# EasyEDA schematic SCH_Ortho90_2023-07-25.json
TITLE: Mainboard; REV: 1.0; Date: 2023-06-22; Sheet: 1/1; Drawn By: Ella Pash
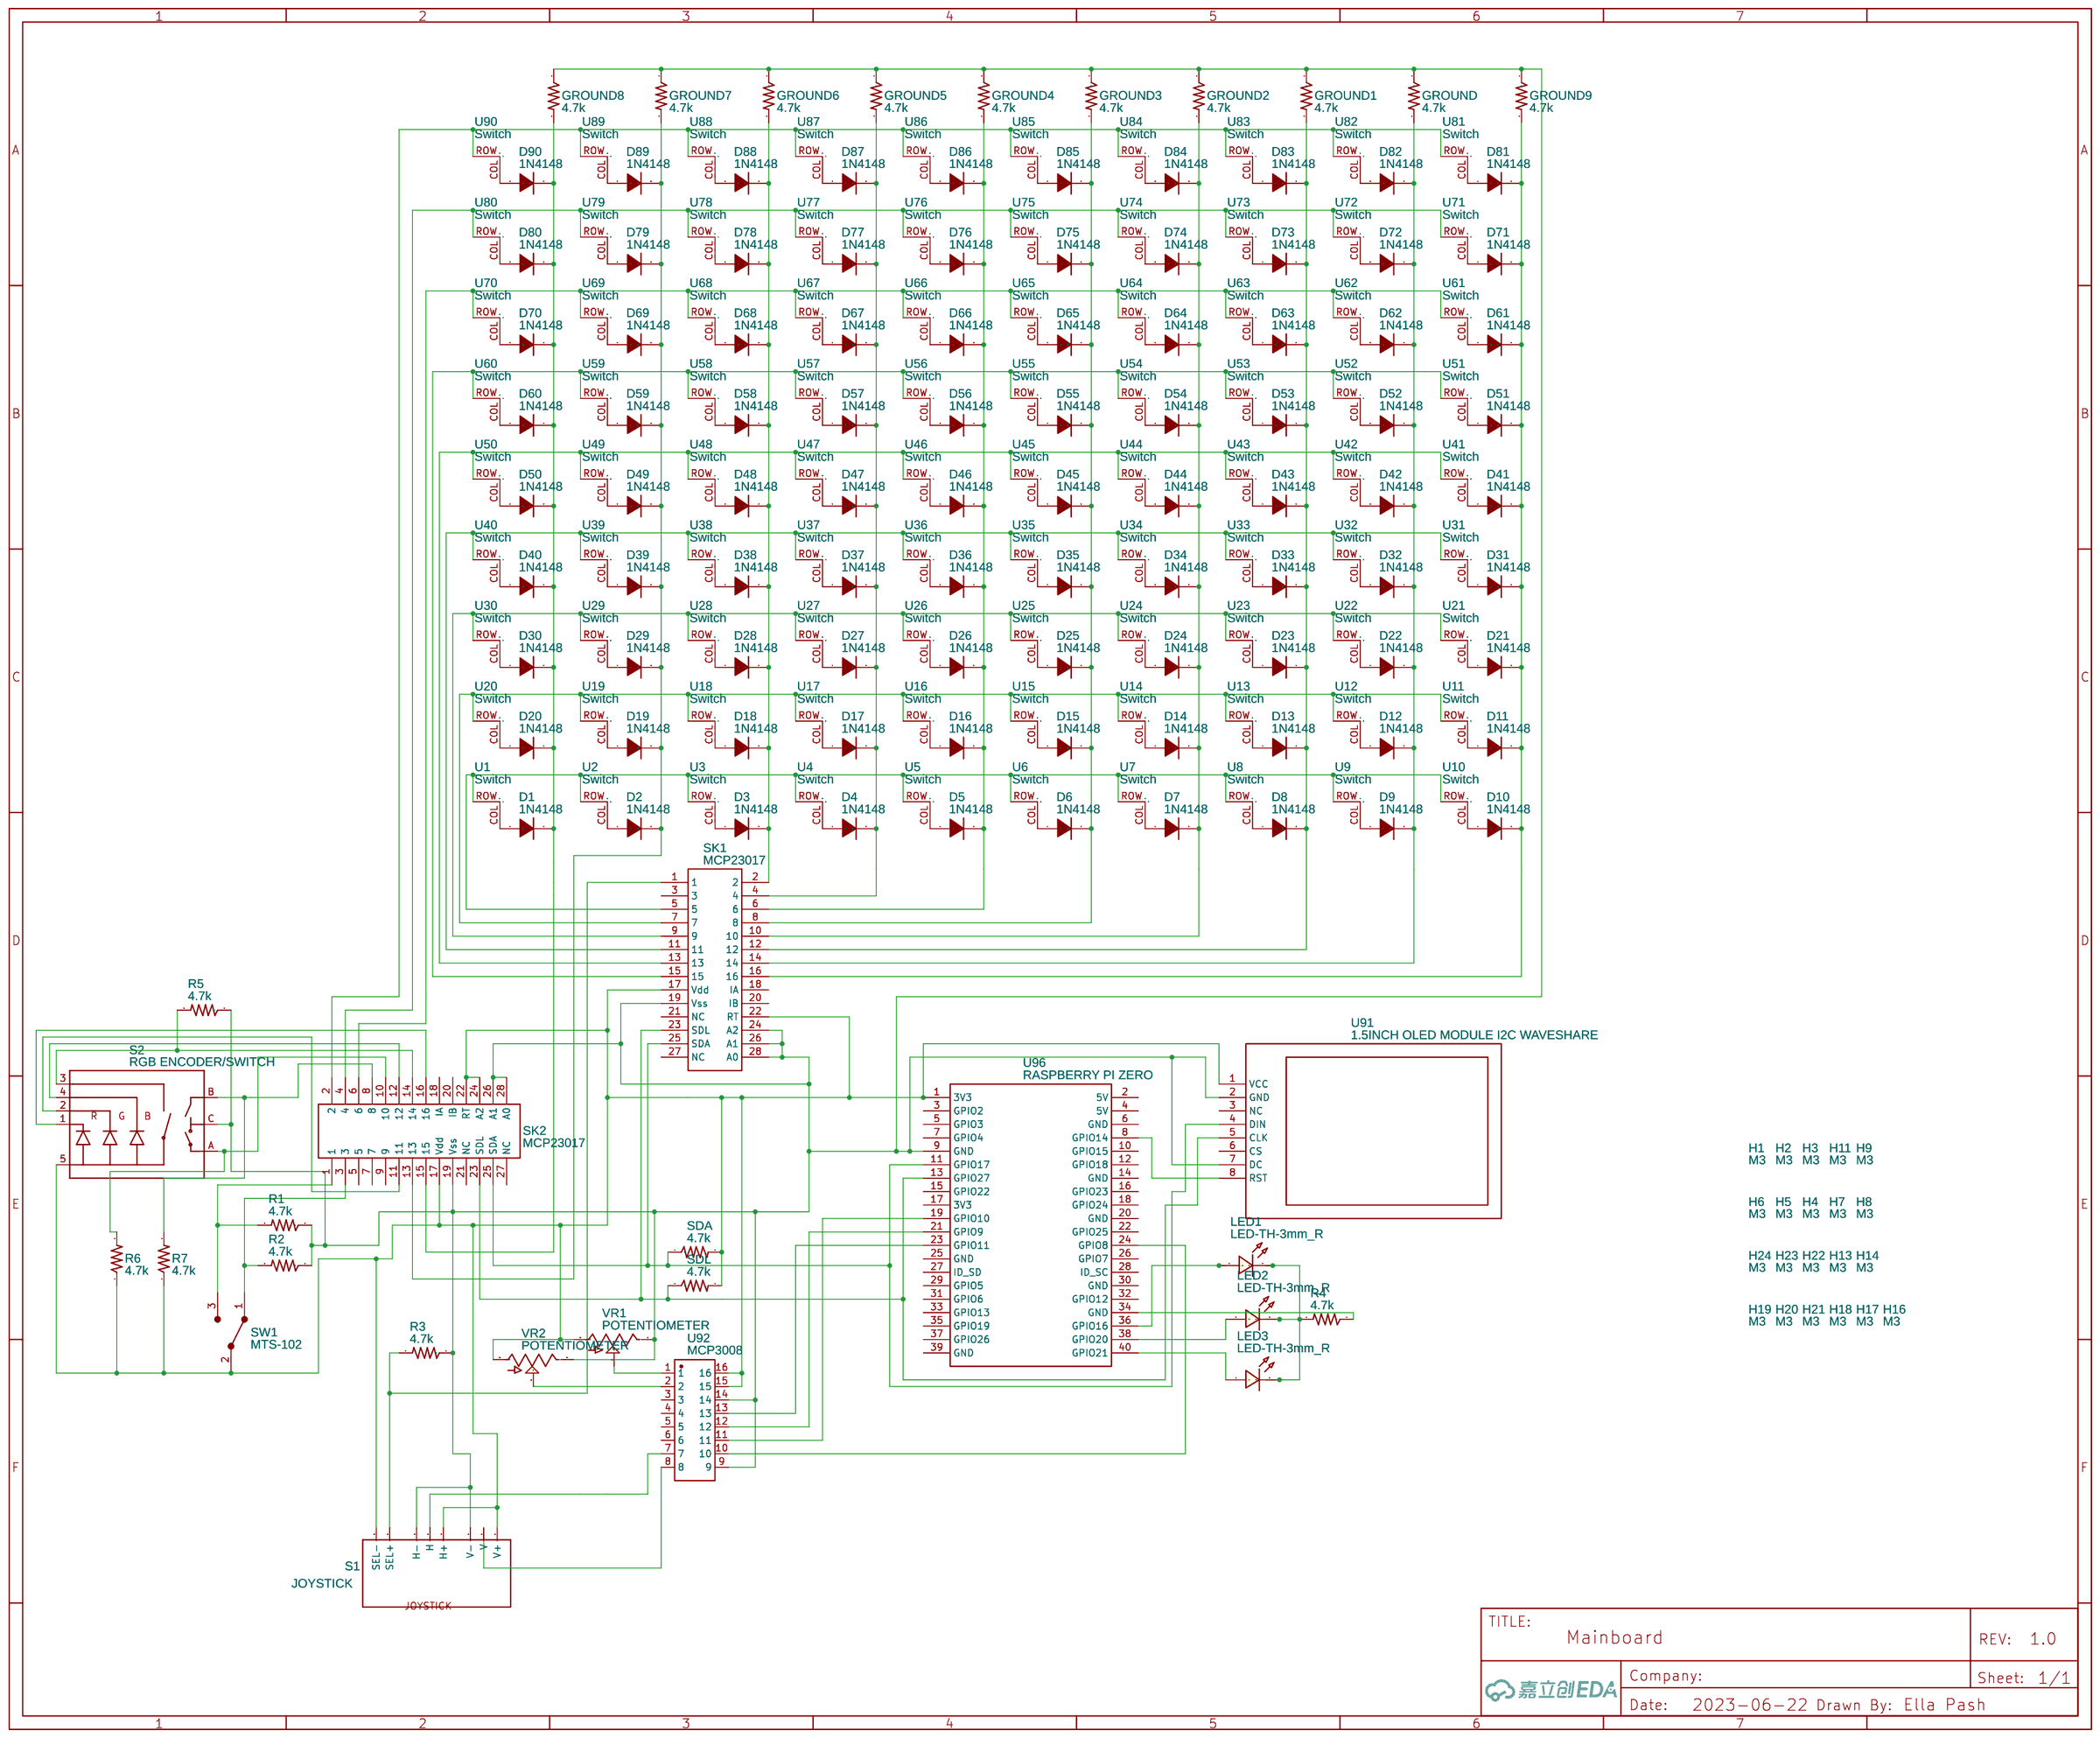
[diagram p0: schematic sheet]

## Parts
D1  1N4148  [DO-35_BD2.0-L4.0-P8.00-D0.5-FD]
D2  1N4148  [DO-35_BD2.0-L4.0-P8.00-D0.5-FD]
D3  1N4148  [DO-35_BD2.0-L4.0-P8.00-D0.5-FD]
D4  1N4148  [DO-35_BD2.0-L4.0-P8.00-D0.5-FD]
D5  1N4148  [DO-35_BD2.0-L4.0-P8.00-D0.5-FD]
D6  1N4148  [DO-35_BD2.0-L4.0-P8.00-D0.5-FD]
D7  1N4148  [DO-35_BD2.0-L4.0-P8.00-D0.5-FD]
D8  1N4148  [DO-35_BD2.0-L4.0-P8.00-D0.5-FD]
D9  1N4148  [DO-35_BD2.0-L4.0-P8.00-D0.5-FD]
D10  1N4148  [DO-35_BD2.0-L4.0-P8.00-D0.5-FD]
D11  1N4148  [DO-35_BD2.0-L4.0-P8.00-D0.5-FD]
D12  1N4148  [DO-35_BD2.0-L4.0-P8.00-D0.5-FD]
D13  1N4148  [DO-35_BD2.0-L4.0-P8.00-D0.5-FD]
D14  1N4148  [DO-35_BD2.0-L4.0-P8.00-D0.5-FD]
D15  1N4148  [DO-35_BD2.0-L4.0-P8.00-D0.5-FD]
D16  1N4148  [DO-35_BD2.0-L4.0-P8.00-D0.5-FD]
D17  1N4148  [DO-35_BD2.0-L4.0-P8.00-D0.5-FD]
D18  1N4148  [DO-35_BD2.0-L4.0-P8.00-D0.5-FD]
D19  1N4148  [DO-35_BD2.0-L4.0-P8.00-D0.5-FD]
D20  1N4148  [DO-35_BD2.0-L4.0-P8.00-D0.5-FD]
D21  1N4148  [DO-35_BD2.0-L4.0-P8.00-D0.5-FD]
D22  1N4148  [DO-35_BD2.0-L4.0-P8.00-D0.5-FD]
D23  1N4148  [DO-35_BD2.0-L4.0-P8.00-D0.5-FD]
D24  1N4148  [DO-35_BD2.0-L4.0-P8.00-D0.5-FD]
D25  1N4148  [DO-35_BD2.0-L4.0-P8.00-D0.5-FD]
D26  1N4148  [DO-35_BD2.0-L4.0-P8.00-D0.5-FD]
D27  1N4148  [DO-35_BD2.0-L4.0-P8.00-D0.5-FD]
D28  1N4148  [DO-35_BD2.0-L4.0-P8.00-D0.5-FD]
D29  1N4148  [DO-35_BD2.0-L4.0-P8.00-D0.5-FD]
D30  1N4148  [DO-35_BD2.0-L4.0-P8.00-D0.5-FD]
D31  1N4148  [DO-35_BD2.0-L4.0-P8.00-D0.5-FD]
D32  1N4148  [DO-35_BD2.0-L4.0-P8.00-D0.5-FD]
D33  1N4148  [DO-35_BD2.0-L4.0-P8.00-D0.5-FD]
D34  1N4148  [DO-35_BD2.0-L4.0-P8.00-D0.5-FD]
D35  1N4148  [DO-35_BD2.0-L4.0-P8.00-D0.5-FD]
D36  1N4148  [DO-35_BD2.0-L4.0-P8.00-D0.5-FD]
D37  1N4148  [DO-35_BD2.0-L4.0-P8.00-D0.5-FD]
D38  1N4148  [DO-35_BD2.0-L4.0-P8.00-D0.5-FD]
D39  1N4148  [DO-35_BD2.0-L4.0-P8.00-D0.5-FD]
D40  1N4148  [DO-35_BD2.0-L4.0-P8.00-D0.5-FD]
D41  1N4148  [DO-35_BD2.0-L4.0-P8.00-D0.5-FD]
D42  1N4148  [DO-35_BD2.0-L4.0-P8.00-D0.5-FD]
D43  1N4148  [DO-35_BD2.0-L4.0-P8.00-D0.5-FD]
D44  1N4148  [DO-35_BD2.0-L4.0-P8.00-D0.5-FD]
D45  1N4148  [DO-35_BD2.0-L4.0-P8.00-D0.5-FD]
D46  1N4148  [DO-35_BD2.0-L4.0-P8.00-D0.5-FD]
D47  1N4148  [DO-35_BD2.0-L4.0-P8.00-D0.5-FD]
D48  1N4148  [DO-35_BD2.0-L4.0-P8.00-D0.5-FD]
D49  1N4148  [DO-35_BD2.0-L4.0-P8.00-D0.5-FD]
D50  1N4148  [DO-35_BD2.0-L4.0-P8.00-D0.5-FD]
D51  1N4148  [DO-35_BD2.0-L4.0-P8.00-D0.5-FD]
D52  1N4148  [DO-35_BD2.0-L4.0-P8.00-D0.5-FD]
D53  1N4148  [DO-35_BD2.0-L4.0-P8.00-D0.5-FD]
D54  1N4148  [DO-35_BD2.0-L4.0-P8.00-D0.5-FD]
D55  1N4148  [DO-35_BD2.0-L4.0-P8.00-D0.5-FD]
D56  1N4148  [DO-35_BD2.0-L4.0-P8.00-D0.5-FD]
D57  1N4148  [DO-35_BD2.0-L4.0-P8.00-D0.5-FD]
D58  1N4148  [DO-35_BD2.0-L4.0-P8.00-D0.5-FD]
D59  1N4148  [DO-35_BD2.0-L4.0-P8.00-D0.5-FD]
D60  1N4148  [DO-35_BD2.0-L4.0-P8.00-D0.5-FD]
D61  1N4148  [DO-35_BD2.0-L4.0-P8.00-D0.5-FD]
D62  1N4148  [DO-35_BD2.0-L4.0-P8.00-D0.5-FD]
D63  1N4148  [DO-35_BD2.0-L4.0-P8.00-D0.5-FD]
D64  1N4148  [DO-35_BD2.0-L4.0-P8.00-D0.5-FD]
D65  1N4148  [DO-35_BD2.0-L4.0-P8.00-D0.5-FD]
D66  1N4148  [DO-35_BD2.0-L4.0-P8.00-D0.5-FD]
D67  1N4148  [DO-35_BD2.0-L4.0-P8.00-D0.5-FD]
D68  1N4148  [DO-35_BD2.0-L4.0-P8.00-D0.5-FD]
D69  1N4148  [DO-35_BD2.0-L4.0-P8.00-D0.5-FD]
D70  1N4148  [DO-35_BD2.0-L4.0-P8.00-D0.5-FD]
D71  1N4148  [DO-35_BD2.0-L4.0-P8.00-D0.5-FD]
D72  1N4148  [DO-35_BD2.0-L4.0-P8.00-D0.5-FD]
D73  1N4148  [DO-35_BD2.0-L4.0-P8.00-D0.5-FD]
D74  1N4148  [DO-35_BD2.0-L4.0-P8.00-D0.5-FD]
D75  1N4148  [DO-35_BD2.0-L4.0-P8.00-D0.5-FD]
D76  1N4148  [DO-35_BD2.0-L4.0-P8.00-D0.5-FD]
D77  1N4148  [DO-35_BD2.0-L4.0-P8.00-D0.5-FD]
D78  1N4148  [DO-35_BD2.0-L4.0-P8.00-D0.5-FD]
D79  1N4148  [DO-35_BD2.0-L4.0-P8.00-D0.5-FD]
D80  1N4148  [DO-35_BD2.0-L4.0-P8.00-D0.5-FD]
D81  1N4148  [DO-35_BD2.0-L4.0-P8.00-D0.5-FD]
D82  1N4148  [DO-35_BD2.0-L4.0-P8.00-D0.5-FD]
D83  1N4148  [DO-35_BD2.0-L4.0-P8.00-D0.5-FD]
D84  1N4148  [DO-35_BD2.0-L4.0-P8.00-D0.5-FD]
D85  1N4148  [DO-35_BD2.0-L4.0-P8.00-D0.5-FD]
D86  1N4148  [DO-35_BD2.0-L4.0-P8.00-D0.5-FD]
D87  1N4148  [DO-35_BD2.0-L4.0-P8.00-D0.5-FD]
D88  1N4148  [DO-35_BD2.0-L4.0-P8.00-D0.5-FD]
D89  1N4148  [DO-35_BD2.0-L4.0-P8.00-D0.5-FD]
D90  1N4148  [DO-35_BD2.0-L4.0-P8.00-D0.5-FD]
GROUND  4.7k  [AXIAL-0.3-KIT]
GROUND1  4.7k  [AXIAL-0.3-KIT]
GROUND2  4.7k  [AXIAL-0.3-KIT]
GROUND3  4.7k  [AXIAL-0.3-KIT]
GROUND4  4.7k  [AXIAL-0.3-KIT]
GROUND5  4.7k  [AXIAL-0.3-KIT]
GROUND6  4.7k  [AXIAL-0.3-KIT]
GROUND7  4.7k  [AXIAL-0.3-KIT]
GROUND8  4.7k  [AXIAL-0.3-KIT]
GROUND9  4.7k  [AXIAL-0.3-KIT]
H1  M3  [MOUNTINGHOLE_3.2MM_M3]
H2  M3  [MOUNTINGHOLE_3.2MM_M3]
H3  M3  [MOUNTINGHOLE_3.2MM_M3]
H4  M3  [MOUNTINGHOLE_3.2MM_M3]
H5  M3  [MOUNTINGHOLE_3.2MM_M3]
H6  M3  [MOUNTINGHOLE_3.2MM_M3]
H7  M3  [MOUNTINGHOLE_3.2MM_M3]
H8  M3  [MOUNTINGHOLE_3.2MM_M3]
H9  M3  [MOUNTINGHOLE_3.2MM_M3]
H11  M3  [MOUNTINGHOLE_3.2MM_M3]
H13  M3  [MOUNTINGHOLE_3.2MM_M3]
H14  M3  [MOUNTINGHOLE_3.2MM_M3]
H16  M3  [MOUNTINGHOLE_3.2MM_M3]
H17  M3  [MOUNTINGHOLE_3.2MM_M3]
H18  M3  [MOUNTINGHOLE_3.2MM_M3]
H19  M3  [MOUNTINGHOLE_3.2MM_M3]
H20  M3  [MOUNTINGHOLE_3.2MM_M3]
H21  M3  [MOUNTINGHOLE_3.2MM_M3]
H22  M3  [MOUNTINGHOLE_3.2MM_M3]
H23  M3  [MOUNTINGHOLE_3.2MM_M3]
H24  M3  [MOUNTINGHOLE_3.2MM_M3]
LED1  LED-TH-3mm_R  [LED-TH_BD3.0_RED]
LED2  LED-TH-3mm_R  [LED-TH_BD3.0_RED]
LED3  LED-TH-3mm_R  [LED-TH_BD3.0_RED]
R1  4.7k  [AXIAL-0.3-KIT]
R2  4.7k  [AXIAL-0.3-KIT]
R3  4.7k  [AXIAL-0.3-KIT]
R4  4.7k  [AXIAL-0.3-KIT]
R5  4.7k  [AXIAL-0.3-KIT]
R6  4.7k  [AXIAL-0.3-KIT]
R7  4.7k  [AXIAL-0.3-KIT]
S1  JOYSTICK  [JOYSTICK]
S2  RGB ENCODER/SWITCH  [ENCODER_LED_3]
SDA  4.7k  [AXIAL-0.3-KIT]
SDL  4.7k  [AXIAL-0.3-KIT]
SK1  MCP23017  [DIP-28_L36.0-W10.2-P2.54-LS10.2-BL]
SK2  MCP23017  [DIP-28_L36.0-W10.2-P2.54-LS10.2-BL]
SW1  MTS-102  [MTS-102]
U1  Switch  [CHERRY MX 1U]
U2  Switch  [CHERRY MX 1U]
U3  Switch  [CHERRY MX 1U]
U4  Switch  [CHERRY MX 1U]
U5  Switch  [CHERRY MX 1U]
U6  Switch  [CHERRY MX 1U]
U7  Switch  [CHERRY MX 1U]
U8  Switch  [CHERRY MX 1U]
U9  Switch  [CHERRY MX 1U]
U10  Switch  [CHERRY MX 1U]
U11  Switch  [CHERRY MX 1U]
U12  Switch  [CHERRY MX 1U]
U13  Switch  [CHERRY MX 1U]
U14  Switch  [CHERRY MX 1U]
U15  Switch  [CHERRY MX 1U]
U16  Switch  [CHERRY MX 1U]
U17  Switch  [CHERRY MX 1U]
U18  Switch  [CHERRY MX 1U]
U19  Switch  [CHERRY MX 1U]
U20  Switch  [CHERRY MX 1U]
U21  Switch  [CHERRY MX 1U]
U22  Switch  [CHERRY MX 1U]
U23  Switch  [CHERRY MX 1U]
U24  Switch  [CHERRY MX 1U]
U25  Switch  [CHERRY MX 1U]
U26  Switch  [CHERRY MX 1U]
U27  Switch  [CHERRY MX 1U]
U28  Switch  [CHERRY MX 1U]
U29  Switch  [CHERRY MX 1U]
U30  Switch  [CHERRY MX 1U]
U31  Switch  [CHERRY MX 1U]
U32  Switch  [CHERRY MX 1U]
U33  Switch  [CHERRY MX 1U]
U34  Switch  [CHERRY MX 1U]
U35  Switch  [CHERRY MX 1U]
U36  Switch  [CHERRY MX 1U]
U37  Switch  [CHERRY MX 1U]
U38  Switch  [CHERRY MX 1U]
U39  Switch  [CHERRY MX 1U]
U40  Switch  [CHERRY MX 1U]
U41  Switch  [CHERRY MX 1U]
U42  Switch  [CHERRY MX 1U]
U43  Switch  [CHERRY MX 1U]
U44  Switch  [CHERRY MX 1U]
U45  Switch  [CHERRY MX 1U]
U46  Switch  [CHERRY MX 1U]
U47  Switch  [CHERRY MX 1U]
U48  Switch  [CHERRY MX 1U]
U49  Switch  [CHERRY MX 1U]
U50  Switch  [CHERRY MX 1U]
U51  Switch  [CHERRY MX 1U]
U52  Switch  [CHERRY MX 1U]
U53  Switch  [CHERRY MX 1U]
U54  Switch  [CHERRY MX 1U]
U55  Switch  [CHERRY MX 1U]
U56  Switch  [CHERRY MX 1U]
U57  Switch  [CHERRY MX 1U]
U58  Switch  [CHERRY MX 1U]
U59  Switch  [CHERRY MX 1U]
U60  Switch  [CHERRY MX 1U]
U61  Switch  [CHERRY MX 1U]
U62  Switch  [CHERRY MX 1U]
U63  Switch  [CHERRY MX 1U]
U64  Switch  [CHERRY MX 1U]
U65  Switch  [CHERRY MX 1U]
U66  Switch  [CHERRY MX 1U]
U67  Switch  [CHERRY MX 1U]
U68  Switch  [CHERRY MX 1U]
U69  Switch  [CHERRY MX 1U]
U70  Switch  [CHERRY MX 1U]
U71  Switch  [CHERRY MX 1U]
U72  Switch  [CHERRY MX 1U]
U73  Switch  [CHERRY MX 1U]
U74  Switch  [CHERRY MX 1U]
U75  Switch  [CHERRY MX 1U]
U76  Switch  [CHERRY MX 1U]
U77  Switch  [CHERRY MX 1U]
U78  Switch  [CHERRY MX 1U]
U79  Switch  [CHERRY MX 1U]
U80  Switch  [CHERRY MX 1U]
U81  Switch  [CHERRY MX 1U]
U82  Switch  [CHERRY MX 1U]
U83  Switch  [CHERRY MX 1U]
U84  Switch  [CHERRY MX 1U]
U85  Switch  [CHERRY MX 1U]
U86  Switch  [CHERRY MX 1U]
U87  Switch  [CHERRY MX 1U]
U88  Switch  [CHERRY MX 1U]
U89  Switch  [CHERRY MX 1U]
U90  Switch  [CHERRY MX 1U]
U91  1.5INCH OLED MODULE I2C WAVESHARE  [1.5INCH OLED MODULE WAVESHARE]
U92  MCP3008  [DIP-16_L20.3-W10.2-P2.54-LS7.6-BL-1]
U96  RASPBERRY PI ZERO  [RASPBERRY-PIZERO-W]
VR1  POTENTIOMETER  [POT-PTH-ALPS]
VR2  POTENTIOMETER  [POT-PTH-ALPS]

## Library data of the parts
D1-D90 = 1N4148: Supplier: LCSC; Manufacturer: ST(先科); Supplier Part: C14516; JLCPCB Part Class: Extended Part
GROUND GROUND1-GROUND9 R1-R7 SDA SDL = RESISTORKIT: Resistor; Contributor: SparkFun
H1-H9 H11 H13 H14 H16-H24 = MountingHole_3.2mm_M3: Contributor: Robson Cozendey; Convert to PCB: Yes; Add into BOM: No
LED1-LED3 = LED-TH-3mm_R: Manufacturer: EVERLIGHT(台湾亿光); Manufacturer Part: 204-10SDRD/S530-A3-L; Supplier Part: C84774; Supplier: LCSC; Contributor: LCEDA_Lib
S1 = JOYSTICK_THUMB: Contributor: ellarushtonpash
S2 = ENCODER-RGB-SWITCH-NO_NUT: Contributor: ellarushtonpash
SK1 SK2 = IC seat: Supplier: LCSC; Supplier Part: C16653; Manufacturer: BOOMELE(博穆精密); Manufacturer Part: IC-28P窄; Contributor: LCSC; JLCPCB Part Class: Extended Part
SW1 = MTS-102: Manufacturer Part: New SchematicLib; Contributor: vladimir_box; Supplier Part: SMTS-202-A2; Supplier: MASSUSE
U1-U90 = Switch: Contributor: ellarushtonpash
U91 = 1.5INCH OLED MODULE SPI-I2C WAVESHARE (HOLE D3.2MM): Manufacturer Part: Waveshare; Contributor: allvex
U92 = IC-16P: Supplier: LCSC; Supplier Part: C5289487; Manufacturer: ZHOURI(洲日); link: https://atta.szlcsc.com/upload/public/pdf/source/20221125/CA58E3030C287CE73D9114A1B28DE960.pdf; Contributor: lcsc
U96 = Raspberry-PiZero-W: Contributor: Emílio Gabriel Dallastella
VR1 VR2 = POTENTIOMETER-PTH-9MM-1/20W-20%: Contributor: ellarushtonpash

## Nets
Net-(D1-1): D1.1(A) U1.COL(2)
Net-(D1-2): D1.2(C) D20.2(C) D30.2(C) D40.2(C) D50.2(C) D60.2(C) D70.2(C) D80.2(C) D90.2(C) GROUND8.2 SK2.15
Net-(D2-1): D2.1(A) U2.COL(2)
Net-(D2-2): D2.2(C) D19.2(C) D29.2(C) D39.2(C) D49.2(C) D59.2(C) D69.2(C) D79.2(C) D89.2(C) GROUND7.2 SK2.13
Net-(D3-1): D3.1(A) U3.COL(2)
Net-(D3-2): D3.2(C) D18.2(C) D28.2(C) D38.2(C) D48.2(C) D58.2(C) D68.2(C) D78.2(C) D88.2(C) GROUND6.2 SK1.2
Net-(D4-1): D4.1(A) U4.COL(2)
Net-(D4-2): D4.2(C) D17.2(C) D27.2(C) D37.2(C) D47.2(C) D57.2(C) D67.2(C) D77.2(C) D87.2(C) GROUND5.2 SK1.4
Net-(D5-1): D5.1(A) U5.COL(2)
Net-(D5-2): D5.2(C) D16.2(C) D26.2(C) D36.2(C) D46.2(C) D56.2(C) D66.2(C) D76.2(C) D86.2(C) GROUND4.2 SK1.6
Net-(D6-1): D6.1(A) U6.COL(2)
Net-(D6-2): D6.2(C) D15.2(C) D25.2(C) D35.2(C) D45.2(C) D55.2(C) D65.2(C) D75.2(C) D85.2(C) GROUND3.2 SK1.8
Net-(D7-1): D7.1(A) U7.COL(2)
Net-(D7-2): D7.2(C) D14.2(C) D24.2(C) D34.2(C) D44.2(C) D54.2(C) D64.2(C) D74.2(C) D84.2(C) GROUND2.2 SK1.10
Net-(D8-1): D8.1(A) U8.COL(2)
Net-(D8-2): D8.2(C) D13.2(C) D23.2(C) D33.2(C) D43.2(C) D53.2(C) D63.2(C) D73.2(C) D83.2(C) GROUND1.2 SK1.12
Net-(D9-1): D9.1(A) U9.COL(2)
Net-(D9-2): D9.2(C) D12.2(C) D22.2(C) D32.2(C) D42.2(C) D52.2(C) D62.2(C) D72.2(C) D82.2(C) GROUND.2 SK1.14
Net-(D10-1): D10.1(A) U10.COL(2)
Net-(D10-2): D10.2(C) D11.2(C) D21.2(C) D31.2(C) D41.2(C) D51.2(C) D61.2(C) D71.2(C) D81.2(C) GROUND9.2 SK1.16
Net-(D11-1): D11.1(A) U11.COL(2)
Net-(D12-1): D12.1(A) U12.COL(2)
Net-(D13-1): D13.1(A) U13.COL(2)
Net-(D14-1): D14.1(A) U14.COL(2)
Net-(D15-1): D15.1(A) U15.COL(2)
Net-(D16-1): D16.1(A) U16.COL(2)
Net-(D17-1): D17.1(A) U17.COL(2)
Net-(D18-1): D18.1(A) U18.COL(2)
Net-(D19-1): D19.1(A) U19.COL(2)
Net-(D20-1): D20.1(A) U20.COL(2)
Net-(D21-1): D21.1(A) U21.COL(2)
Net-(D22-1): D22.1(A) U22.COL(2)
Net-(D23-1): D23.1(A) U23.COL(2)
Net-(D24-1): D24.1(A) U24.COL(2)
Net-(D25-1): D25.1(A) U25.COL(2)
Net-(D26-1): D26.1(A) U26.COL(2)
Net-(D27-1): D27.1(A) U27.COL(2)
Net-(D28-1): D28.1(A) U28.COL(2)
Net-(D29-1): D29.1(A) U29.COL(2)
Net-(D30-1): D30.1(A) U30.COL(2)
Net-(D31-1): D31.1(A) U31.COL(2)
Net-(D32-1): D32.1(A) U32.COL(2)
Net-(D33-1): D33.1(A) U33.COL(2)
Net-(D34-1): D34.1(A) U34.COL(2)
Net-(D35-1): D35.1(A) U35.COL(2)
Net-(D36-1): D36.1(A) U36.COL(2)
Net-(D37-1): D37.1(A) U37.COL(2)
Net-(D38-1): D38.1(A) U38.COL(2)
Net-(D39-1): D39.1(A) U39.COL(2)
Net-(D40-1): D40.1(A) U40.COL(2)
Net-(D41-1): D41.1(A) U41.COL(2)
Net-(D42-1): D42.1(A) U42.COL(2)
Net-(D43-1): D43.1(A) U43.COL(2)
Net-(D44-1): D44.1(A) U44.COL(2)
Net-(D45-1): D45.1(A) U45.COL(2)
Net-(D46-1): D46.1(A) U46.COL(2)
Net-(D47-1): D47.1(A) U47.COL(2)
Net-(D48-1): D48.1(A) U48.COL(2)
Net-(D49-1): D49.1(A) U49.COL(2)
Net-(D50-1): D50.1(A) U50.COL(2)
Net-(D51-1): D51.1(A) U51.COL(2)
Net-(D52-1): D52.1(A) U52.COL(2)
Net-(D53-1): D53.1(A) U53.COL(2)
Net-(D54-1): D54.1(A) U54.COL(2)
Net-(D55-1): D55.1(A) U55.COL(2)
Net-(D56-1): D56.1(A) U56.COL(2)
Net-(D57-1): D57.1(A) U57.COL(2)
Net-(D58-1): D58.1(A) U58.COL(2)
Net-(D59-1): D59.1(A) U59.COL(2)
Net-(D60-1): D60.1(A) U60.COL(2)
Net-(D61-1): D61.1(A) U61.COL(2)
Net-(D62-1): D62.1(A) U62.COL(2)
Net-(D63-1): D63.1(A) U63.COL(2)
Net-(D64-1): D64.1(A) U64.COL(2)
Net-(D65-1): D65.1(A) U65.COL(2)
Net-(D66-1): D66.1(A) U66.COL(2)
Net-(D67-1): D67.1(A) U67.COL(2)
Net-(D68-1): D68.1(A) U68.COL(2)
Net-(D69-1): D69.1(A) U69.COL(2)
Net-(D70-1): D70.1(A) U70.COL(2)
Net-(D71-1): D71.1(A) U71.COL(2)
Net-(D72-1): D72.1(A) U72.COL(2)
Net-(D73-1): D73.1(A) U73.COL(2)
Net-(D74-1): D74.1(A) U74.COL(2)
Net-(D75-1): D75.1(A) U75.COL(2)
Net-(D76-1): D76.1(A) U76.COL(2)
Net-(D77-1): D77.1(A) U77.COL(2)
Net-(D78-1): D78.1(A) U78.COL(2)
Net-(D79-1): D79.1(A) U79.COL(2)
Net-(D80-1): D80.1(A) U80.COL(2)
Net-(D81-1): D81.1(A) U81.COL(2)
Net-(D82-1): D82.1(A) U82.COL(2)
Net-(D83-1): D83.1(A) U83.COL(2)
Net-(D84-1): D84.1(A) U84.COL(2)
Net-(D85-1): D85.1(A) U85.COL(2)
Net-(D86-1): D86.1(A) U86.COL(2)
Net-(D87-1): D87.1(A) U87.COL(2)
Net-(D88-1): D88.1(A) U88.COL(2)
Net-(D89-1): D89.1(A) U89.COL(2)
Net-(D90-1): D90.1(A) U90.COL(2)
Net-(GROUND-1): GROUND.1 GROUND1.1 GROUND2.1 GROUND3.1 GROUND4.1 GROUND5.1 GROUND6.1 GROUND7.1 GROUND8.1 GROUND9.1 R1.1 R2.1 R3.1 R5.1 S1.H3(H-) S1.V3(V-) S2.C SK1.19(Vss) SK1.24(A2) SK1.26(A1) SK1.28(A0) SK2.19(Vss) SK2.26(A1) SK2.28(A0) U91.2(GND) U91.7(DC) U92.9 U92.14 U96.9(GND) VR1.P$1(E) VR2.P$1(E)
Net-(LED1-1): LED1.1 U96.36(GPIO16)
Net-(LED1-2): LED1.2 LED2.2 LED3.2 R4.2
Net-(LED2-1): LED2.1 U96.38(GPIO20)
Net-(LED3-1): LED3.1 U96.40(GPIO21)
Net-(R1-2): R1.2 SK2.1 SW1.3
Net-(R2-2): R2.2 SK2.3 SW1.1
Net-(R3-2): R3.2 S1.B1A(SEL+) SK1.1
Net-(R4-1): R4.1 U96.34(GND)
Net-(R5-2): R5.2 S2.3(SW) SK2.14
Net-(R6-1): R6.1 R7.1 S1.B2A(SEL-) S1.H1(H+) S1.V1(V+) S2.5(+) SDA.2 SDL.2 SK1.17(Vdd) SK1.22(RT) SK2.17(Vdd) SK2.22(RT) SK2.24(A2) SW1.2 U91.1(VCC) U92.15 U92.16 U96.1(3V3) VR1.P$3(A) VR2.P$3(A)
Net-(R6-2): R6.2 S2.A SK2.10
Net-(R7-2): R7.2 S2.B SK2.8
Net-(S1-H2): S1.H2(H) U92.7
Net-(S1-V2): S1.V2(V) U92.8
Net-(S2-1): S2.1(-R) SK2.16
Net-(S2-2): S2.2(-G) SK2.11
Net-(S2-4): S2.4(-B) SK2.12
Net-(SDA-1): SDA.1 SK1.25(SDA) SK2.25(SDA) U91.4(DIN) U96.11(GPIO17)
Net-(SDL-1): SDL.1 SK1.23(SDL) SK2.23(SDL) U91.5(CLK) U96.13(GPIO27)
Net-(SK1-5): SK1.5 U1.ROW(1) U2.ROW(1) U3.ROW(1) U4.ROW(1) U5.ROW(1) U6.ROW(1) U7.ROW(1) U8.ROW(1) U9.ROW(1) U10.ROW(1)
Net-(SK1-7): SK1.7 U11.ROW(1) U12.ROW(1) U13.ROW(1) U14.ROW(1) U15.ROW(1) U16.ROW(1) U17.ROW(1) U18.ROW(1) U19.ROW(1) U20.ROW(1)
Net-(SK1-9): SK1.9 U21.ROW(1) U22.ROW(1) U23.ROW(1) U24.ROW(1) U25.ROW(1) U26.ROW(1) U27.ROW(1) U28.ROW(1) U29.ROW(1) U30.ROW(1)
Net-(SK1-11): SK1.11 U31.ROW(1) U32.ROW(1) U33.ROW(1) U34.ROW(1) U35.ROW(1) U36.ROW(1) U37.ROW(1) U38.ROW(1) U39.ROW(1) U40.ROW(1)
Net-(SK1-13): SK1.13 U41.ROW(1) U42.ROW(1) U43.ROW(1) U44.ROW(1) U45.ROW(1) U46.ROW(1) U47.ROW(1) U48.ROW(1) U49.ROW(1) U50.ROW(1)
Net-(SK1-15): SK1.15 U51.ROW(1) U52.ROW(1) U53.ROW(1) U54.ROW(1) U55.ROW(1) U56.ROW(1) U57.ROW(1) U58.ROW(1) U59.ROW(1) U60.ROW(1)
Net-(SK2-2): SK2.2 U81.ROW(1) U82.ROW(1) U83.ROW(1) U84.ROW(1) U85.ROW(1) U86.ROW(1) U87.ROW(1) U88.ROW(1) U89.ROW(1) U90.ROW(1)
Net-(SK2-4): SK2.4 U71.ROW(1) U72.ROW(1) U73.ROW(1) U74.ROW(1) U75.ROW(1) U76.ROW(1) U77.ROW(1) U78.ROW(1) U79.ROW(1) U80.ROW(1)
Net-(SK2-6): SK2.6 U61.ROW(1) U62.ROW(1) U63.ROW(1) U64.ROW(1) U65.ROW(1) U66.ROW(1) U67.ROW(1) U68.ROW(1) U69.ROW(1) U70.ROW(1)
Net-(U91-8): U91.8(RST) U96.8(GPIO14)
Net-(U92-1): U92.1 VR1.P$2(S)
Net-(U92-2): U92.2 VR2.P$2(S)
Net-(U92-10): U92.10 U96.24(GPIO8)
Net-(U92-11): U92.11 U96.19(GPIO10)
Net-(U92-12): U92.12 U96.21(GPIO9)
Net-(U92-13): U92.13 U96.23(GPIO11)

Not connected (* = marked no-connect by the designer): SK1 3 18(IA) 20(IB) 21(NC) 27(NC); SK2 5 7 9 18(IA) 20(IB) 21(NC) 27(NC); U91 3(NC) 6(CS); U92 3 4 5 6; U96 2(5V) 3(GPIO2) 4(5V) 5(GPIO3) 6(GND) 7(GPIO4) 10(GPIO15) 12(GPIO18) 14(GND) 15(GPIO22) 16(GPIO23) 17(3V3) 18(GPIO24) 20(GND) 22(GPIO25) 25(GND) 26(GPIO7) 27(ID_SD) 28(ID_SC) 29(GPIO5) 30(GND) 31(GPIO6) 32(GPIO12) 33(GPIO13) 35(GPIO19) 37(GPIO26) 39(GND)
